# Altium schematic sheet Main.SchDoc: Connectors
size B; DocumentNumber: 1; SheetNumber: 1; SheetTotal: 6
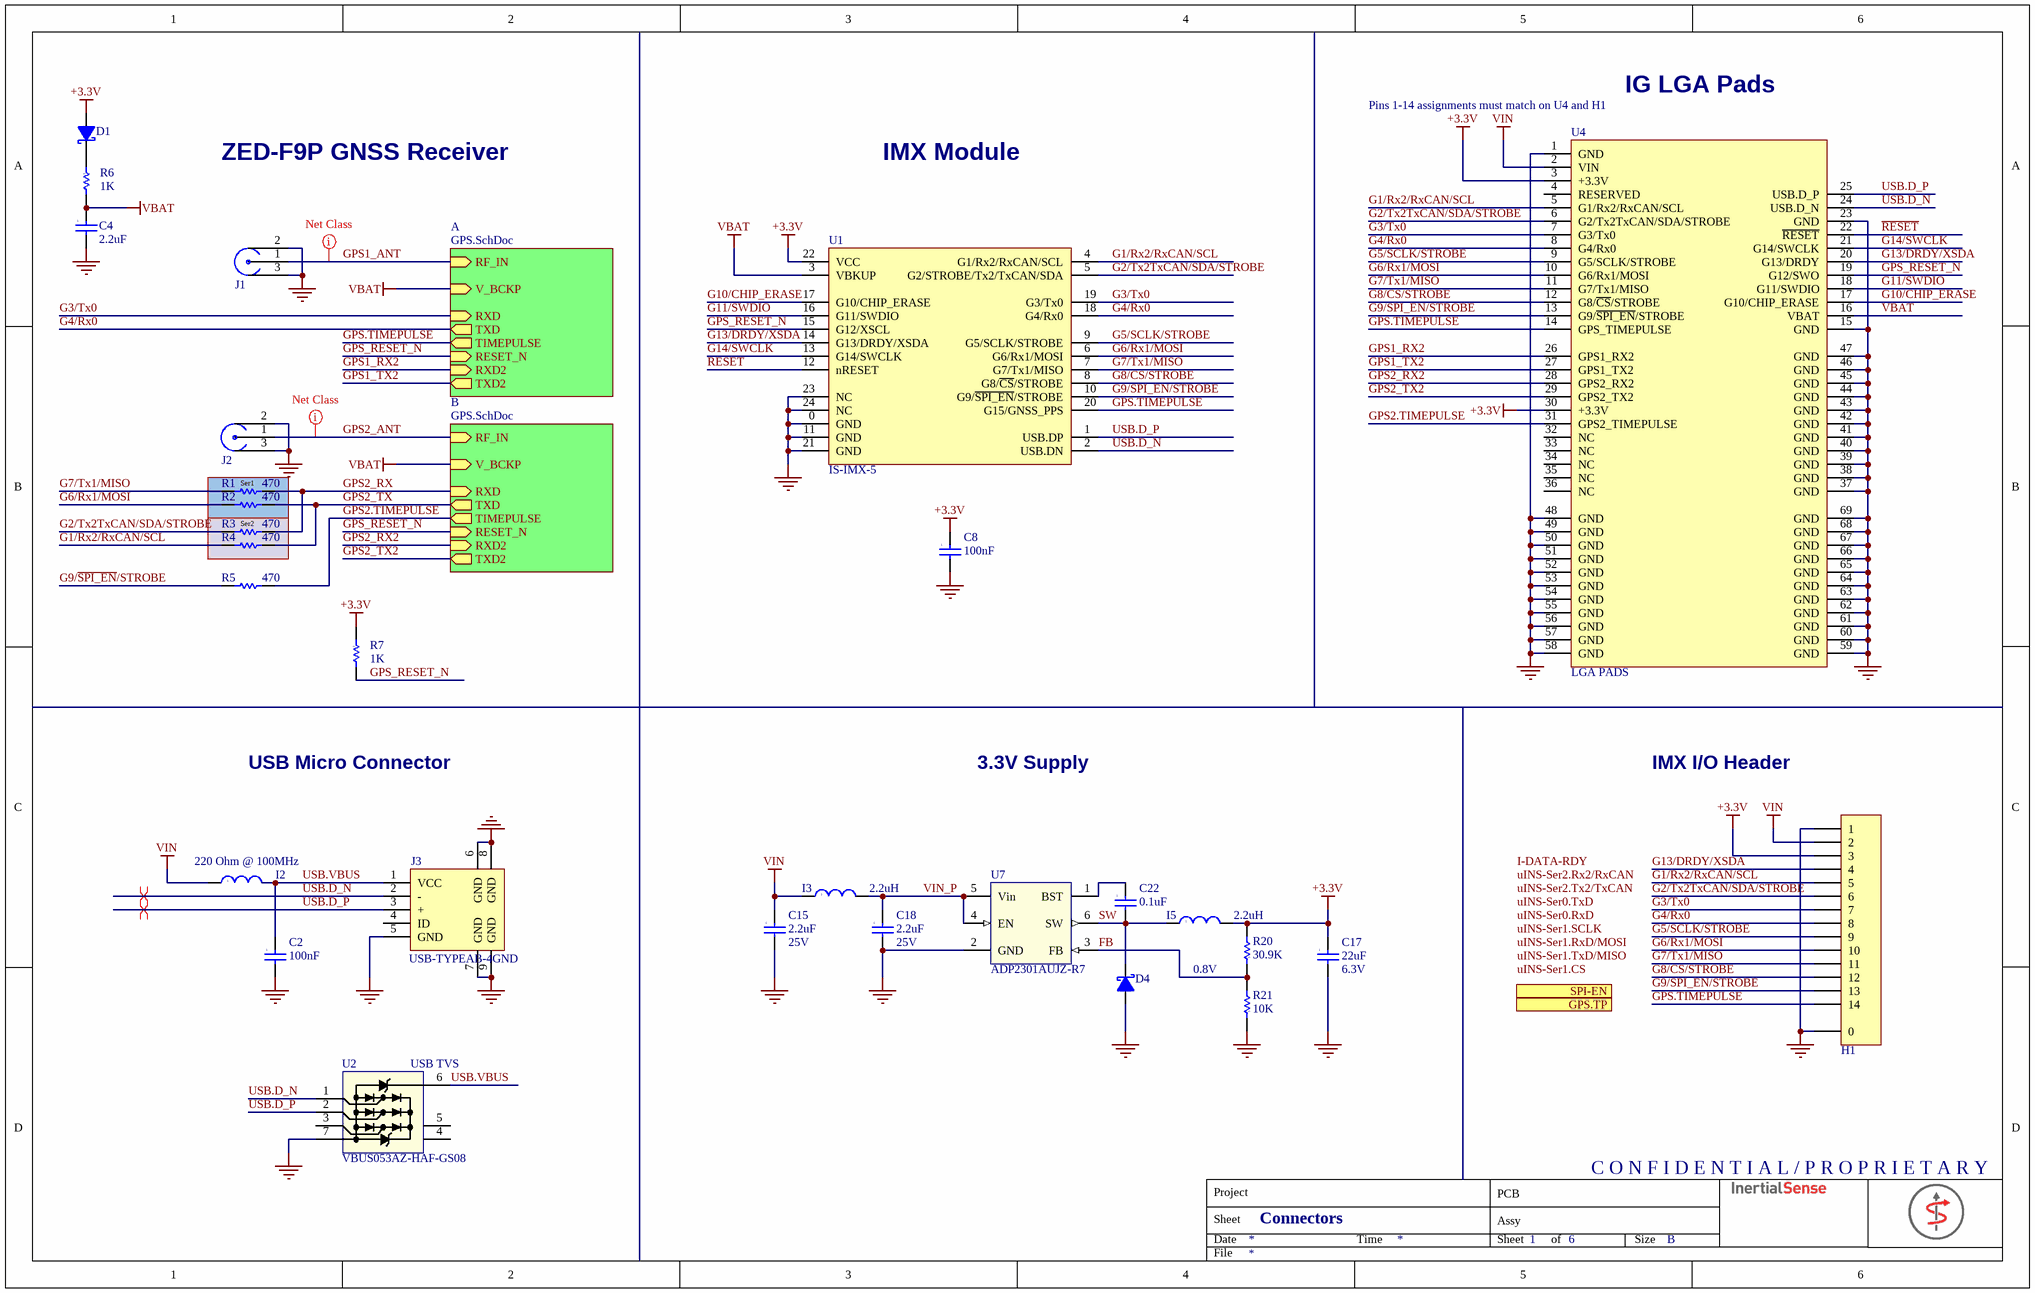
[diagram p0: Main.SchDoc]

## Parts
C2  value 100nF  [0402]  (hidden comment: Cap)
C4  value 2.2uF  [0402]  (hidden comment: Cap)
C8  value 100nF  [0402]  (hidden comment: Cap)
C15  value 2.2uF  Voltage Rating: 25V  [0603]  (hidden comment: Cap)
C17  value 22uF  Voltage Rating: 6.3V  [0603]  (hidden comment: Cap)
C18  value 2.2uF  Voltage Rating: 25V  [0603]  (hidden comment: Cap)
C22  value 0.1uF  [0402]  (hidden comment: Cap)
D1  Diode - Schottky  [D0603B]  (value not drawn)
D4  Diode - Schottky  [D0603B]  (value not drawn)
H1  Hdr - 14pin - mount  [SM14B-GHS-TB(LF)(SN)]  (value not drawn)
I2  value 220 Ohm @ 100MHz  [I0603]  (hidden comment: Inductor)
I3  value 2.2uH  [0806]  (hidden comment: Inductor)
I5  value 2.2uH  [0806]  (hidden comment: Inductor)
J1  RF - GND x 2  [RF UMC SMD]  (value not drawn)
J2  RF - GND x 2  [RF UMC SMD]  (value not drawn)
J3  USB-TYPEAB-4GND  [USB Micro AB R/A THR]
R1  value 470  [R0402]  (hidden comment: Res)
R2  value 470  [R0402]  (hidden comment: Res)
R3  value 470  [R0402]  (hidden comment: Res)
R4  value 470  [R0402]  (hidden comment: Res)
R5  value 470  [R0402]  (hidden comment: Res)
R6  value 1K  [R0402]  (hidden comment: Res)
R7  value 1K  [R0402]  (hidden comment: Res)
R20  value 30.9K  [R0402]  (hidden comment: Res)
R21  value 10K  [R0402]  (hidden comment: Res)
U1  Manufacturer Part Number: IS-IMX-5  [IS-IMX-5.0]  (hidden comment: IMX)
U2  Manufacturer Part Number: VBUS053AZ-HAF-GS08  [QFN50P160X160X60-6N]  (hidden comment: VBUS053)
U4  LGA PADS  [IG-1.2-G2_LGA]
U7  Manufacturer Part Number: ADP2301AUJZ-R7  [MO-178-AB]  (hidden comment: ADP2301)

## Sub-sheets
A = GPS.SchDoc: TXD (out), TIMEPULSE (out), RXD (in), V_BCKP (in), RF_IN (in), RESET_N (in), TXD2 (out), RXD2 (in)
B = GPS.SchDoc: TXD (out), TIMEPULSE (out), RXD (in), V_BCKP (in), RF_IN (in), RESET_N (in), TXD2 (out), RXD2 (in)

## Ports
GPS.TP (out), SPI-EN (in)

## Nets
+3.3V: C8.1 C17.1 D1.A H1.3 I5.2 R7.1 R20.2 U1.22(VCC) U4.3(+3.3V) U4.30(+3.3V)
GND: C2.2 C4.2 C8.2 C15.2 C17.2 C18.2 D4.A H1.0 H1.1 J1.2 J1.3 J2.2 J2.3 J3.5(GND) J3.6(GND) J3.7(GND) J3.8(GND) J3.9(GND) R21.1 U1.0(GND) U1.11(GND) U1.21(GND) U1.23(NC) U1.24(NC) U2.7 U4.1(GND) U4.15(GND) U4.23(GND) U4.37(GND) U4.38(GND) U4.39(GND) U4.40(GND) U4.41(GND) U4.42(GND) U4.43(GND) U4.44(GND) U4.45(GND) U4.46(GND) U4.47(GND) U4.48(GND) U4.49(GND) U4.50(GND) U4.51(GND) U4.52(GND) U4.53(GND) U4.54(GND) U4.55(GND) U4.56(GND) U4.57(GND) U4.58(GND) U4.59(GND) U4.60(GND) U4.61(GND) U4.62(GND) U4.63(GND) U4.64(GND) U4.65(GND) U4.66(GND) U4.67(GND) U4.68(GND) U4.69(GND) U7.2(GND)
VBAT: C4.1 R6.2 U1.3(VBKUP) U4.16(VBAT) ; sheet A/V_BCKP, sheet B/V_BCKP
VIN: C15.1 H1.2 I2.1 I3.1 U4.2(VIN)
~{RESET}: U1.12(nRESET) U4.22(~{RESET})
FB: R20.1 R21.2 U7.3(FB)
G1/Rx2/RxCAN/SCL: H1.5 R4.1 U1.4(G1/Rx2/RxCAN/SCL) U4.5(G1/Rx2/RxCAN/SCL)
G2/Tx2TxCAN/SDA/STROBE: H1.6 R3.1 U1.5(G2/STROBE/Tx2/TxCAN/SDA) U4.6(G2/Tx2TxCAN/SDA/STROBE)
G3/Tx0: H1.7 U1.19(G3/Tx0) U4.7(G3/Tx0) ; sheet A/RXD
G4/Rx0: H1.8 U1.18(G4/Rx0) U4.8(G4/Rx0) ; sheet A/TXD
G5/SCLK/STROBE: H1.9 U1.9(G5/SCLK/STROBE) U4.9(G5/SCLK/STROBE)
G6/Rx1/MOSI: H1.10 R2.1 U1.6(G6/Rx1/MOSI) U4.10(G6/Rx1/MOSI)
G7/Tx1/MISO: H1.11 R1.1 U1.7(G7/Tx1/MISO) U4.11(G7/Tx1/MISO)
G8/~{CS}/STROBE: H1.12 U1.8(G8/~{CS}/STROBE) U4.12(G8/~{CS}/STROBE)
G9/~{SPI_EN}/STROBE: H1.13 R5.1 U1.10(G9/~{SPI_EN}/STROBE) U4.13(G9/~{SPI_EN}/STROBE)
G10/CHIP_ERASE: U1.17(G10/CHIP_ERASE) U4.17(G10/CHIP_ERASE)
G11/SWDIO: U1.16(G11/SWDIO) U4.18(G11/SWDIO)
G13/DRDY/XSDA: H1.4 U1.14(G13/DRDY/XSDA) U4.20(G13/DRDY)
G14/SWCLK: U1.13(G14/SWCLK) U4.21(G14/SWCLK)
GPS1_ANT: J1.1 ; sheet A/RF_IN
GPS1_RX2: U4.26(GPS1_RX2) ; sheet A/RXD2
GPS1_TX2: U4.27(GPS1_TX2) ; sheet A/TXD2
GPS2.TIMEPULSE: R5.2 U4.31(GPS2_TIMEPULSE) ; sheet B/TIMEPULSE
GPS2_ANT: J2.1 ; sheet B/RF_IN
GPS2_RX: R1.2 R3.2 ; sheet B/RXD
GPS2_RX2: U4.28(GPS2_RX2) ; sheet B/RXD2
GPS2_TX: R2.2 R4.2 ; sheet B/TXD
GPS2_TX2: U4.29(GPS2_TX2) ; sheet B/TXD2
GPS.TIMEPULSE: H1.14 U1.20(G15/GNSS_PPS) U4.14(GPS_TIMEPULSE) ; sheet A/TIMEPULSE
GPS_RESET_N: R7.2 U1.15(G12/XSCL) U4.19(G12/SWO) ; sheet A/RESET_N, sheet B/RESET_N
SW: C22.2 D4.C I5.1 U7.6(SW)
USB.D_N: J3.2(-) U1.2(USB.DN) U2.1 U4.24(USB.D_N)
USB.D_P: J3.3(+) U1.1(USB.DP) U2.2 U4.25(USB.D_P)
USB.VBUS: C2.1 I2.2 J3.1(VCC) U2.6
VIN_P: C18.1 I3.2 U7.4(EN) U7.5(Vin)
NetC22_1: C22.1 U7.1(BST)
NetD1_C: D1.C R6.1

Not connected (* = marked no-connect by the designer): J3 4(ID); U2 3 4(nc) 5(nc); U4 4(RESERVED) 32(NC) 33(NC) 34(NC) 35(NC) 36(NC)

## Layout directives
net class RF_GPS: GPS1_ANT, GPS2_ANT
differential pair; differential pair class USB: USB.D_N, USB.D_P

## Notes on the sheet
- IG LGA Pads
- ZED-F9P GNSS Receiver
- IMX Module
- (near U4) Pins 1-14 assignments must match on U4 and H1
- Ser1
- Ser2
- USB Micro Connector
- 3.3V Supply
- IMX I/O Header
- 0.8V
- (near U2) USB TVS
- Labels drawn without touching a wire or pin: I-DATA-RDY, uINS-Ser0.RxD, uINS-Ser0.TxD, uINS-Ser1.CS, uINS-Ser1.RxD/MOSI, uINS-Ser1.SCLK, uINS-Ser1.TxD/MISO, uINS-Ser2.Rx2/RxCAN, uINS-Ser2.Tx2/TxCAN
- C O N F I D E N T I A L / P R O P R I E T A R Y
- Date
- Sheet
- Project
- Time
- PCB
- Assy
- of
- Size
- B
- File

## Library data of the parts
C2 C8 = Cap: CAP CER .10UF 50V X7R 10% 0402; Manufacturer: TDK Corporation; Manufacturer Part Number: C1005X7R1H104K; Capacitance: 0.1µF; Published: 8-Jun-2000; LatestRevisionDate: 17-Jul-2002; LatestRevisionNote: Re-released for DXP Platform.; Publisher: Altium Limited; Category: Capacitors; Supplier 1: Digi-Key; Supplier Part Number 1: 445-5932-1-ND; RoHS: RoHS Compliant; Stock 1: 174080; Pricing 1: 1=0.3, 10=0.2, 100=0.08, 250=0.05752, 500=0.041, 1000=0.03 (USD); Voltage - Rated: 50V; Tolerance: ±10%; Temperature Coefficient: X7R; Mounting Type: Surface Mount, MLCC; Operating Temperature: -55°C ~ 125°C; Applications: General Purpose; Ratings: -; Package / Case: 0402 (1005 Metric); Size / Dimension: 0.039" L x 0.020" W (1.00mm x 0.50mm); Height: -; Thickness: 0.022" (0.55mm); Lead Spacing: -; Features: -; Packaging: Cut Tape (CT); Lead Style: -; ComponentLink1URL: http://www.tdk.co.jp/tefe02/e412_c.pdf; ComponentLink1Description: http://www.tdk.co.jp/tefe02/e412_c.pdf
C4 = Cap: 0402 2.2 uF 6.3 V ±10% Tolerance X6S Multilayer Ceramic Capacitor; Manufacturer: Murata; Manufacturer Part Number: GRM155C80J225KE95D; Voltage Rating: 6.3V; Published: 8-Jun-2000; LatestRevisionDate: 17-Jul-2002; LatestRevisionNote: Re-released for DXP Platform.; Publisher: Altium Limited; Category: Capacitors; Supplier: Digi-Key; Supplier Part Number: 490-10012-2-ND; RoHS: Yes; Stock: 7200000; Pricing: 10000=0.01548, 20000=0.01475, 30000=0.01401, 50000=0.01253, 100000=0.01014, 250000=0.00922 (USD); Mounting Technology: Surface Mount; Case/Package: 0402; Case Code (Metric): 1005; Material: Ceramic; Case Code (Imperial): 0402; Min Operating Temperature: -55°C; Max Operating Temperature: 105°C; Tolerance: 10%; Packaging: Cut Tape; Voltage Rating (DC): 6.3V; Series: GRM; Length: 0.039inch; Width: 0.02inch; Height: 0.3mm; Thickness: 0.022inch; RoHS Compliant: Yes; ComponentLink1URL: http://search.murata.co.jp/Ceramy/image/img/A01X/G101/ENG/GRM155C80J225KE95-01.pdf?src-supplier=Digi-Key; ComponentLink1Description: http://search.murata.co.jp/Ceramy/image/img/A01X/G101/ENG/GRM155C80J225KE95-01.pdf?src-supplier=Digi-Key; ComponentLink2URL: http://search.murata.co.jp/Ceramy/image/img/A01X/partnumbering_e_01.pdf?src-supplier=Digi-Key; ComponentLink2Description: http://search.murata.co.jp/Ceramy/image/img/A01X/partnumbering_e_01.pdf?src-supplier=Digi-Key
C15 C18 = Cap: CAP CER 2.2UF 25V X6S 0603; Manufacturer: Murata; Manufacturer Part Number: GRT188C81E225KE13D; Tolerance: 10%; Published: 8-Jun-2000; LatestRevisionDate: 17-Jul-2002; LatestRevisionNote: Re-released for DXP Platform.; Publisher: Altium Limited; Category: Capacitors; Supplier 1: Digi-Key; Supplier Part Number 1: 490-12293-6-ND; Stock 1: 16854; Pricing 1: 1=0.35, 10=0.239, 100=0.1355, 500=0.09564, 1000=0.08369 (USD); Mount: Surface Mount; Case/Package: 0603; Case Code (Metric): 1608; Case Code (Imperial): 0603; Min Operating Temperature: -55°C; Max Operating Temperature: 105°C; Packaging: Tape and Reel; Capacitance: 2.2uF; Dielectric: X6S; Voltage Rating (DC): 25V; Length: 0.063inch; Width: 0.031inch; Thickness: 0.035inch; ComponentLink1URL: http://www.farnell.com/datasheets/2165949.pdf; ComponentLink1Description: http://www.farnell.com/datasheets/2165949.pdf; ComponentLink2URL: http://search.murata.co.jp/Ceramy/image/img/A01X/G101/ENG/GRT188C81E225KE13-01.pdf; ComponentLink2Description: http://search.murata.co.jp/Ceramy/image/img/A01X/G101/ENG/GRT188C81E225KE13-01.pdf
C17 = Cap: CAP CER 22UF 6.3V X6S 0603; Manufacturer: Murata; Manufacturer Part Number: GRM188C80J226ME15D; Tolerance: 20%; Published: 8-Jun-2000; LatestRevisionDate: 17-Jul-2002; LatestRevisionNote: Re-released for DXP Platform.; Publisher: Altium Limited; Category: Capacitors; Supplier 1: Digi-Key; Supplier Part Number 1: 490-10471-6-ND; Stock 1: 0; Pricing 1: 1=0.25, 10=0.168, 100=0.0955, 500=0.0674, 1000=0.05897 (USD); Mount: Surface Mount; Case/Package: 0603; Weight: 0.000222oz; Case Code (Metric): 1608; Case Code (Imperial): 0603; Min Operating Temperature: -55°C; Max Operating Temperature: 105°C; Capacitance: 22uF; Packaging: Tape and Reel; Dielectric: X6S; Termination: SMD/SMT; Voltage Rating (DC): 6.3V; Package Quantity: 4000; Length: 0.063inch; Height: 0.8mm; Width: 0.8mm; Thickness: 0.039inch; Lead Free: Lead Free; ComponentLink1URL: http://www.mouser.com/ds/2/281/c02e-2905.pdf; ComponentLink1Description: http://www.mouser.com/ds/2/281/c02e-2905.pdf; ComponentLink2URL: http://search.murata.co.jp/Ceramy/image/img/A01X/partnumbering_e_01.pdf; ComponentLink2Description: http://search.murata.co.jp/Ceramy/image/img/A01X/partnumbering_e_01.pdf
C22 = Cap: CAP CER 0.1UF 50V X7R 0402; Manufacturer: TDK; Manufacturer Part Number: CGA2B3X7R1H104K050BB; Tolerance: 10%; Published: 8-Jun-2000; LatestRevisionDate: 17-Jul-2002; LatestRevisionNote: Re-released for DXP Platform.; Publisher: Altium Limited; Category: Capacitors; Supplier 1: Digi-Key; Supplier Part Number 1: 445-6899-1-ND; Stock 1: 12402793; Pricing 1: 1=0.16000, 10=0.11700, 100=0.05500, 500=0.03858, 1000=0.03194, 2500=0.02973, 5000=0.02720 (USD); RoHS: Yes; Mount: Surface Mount; Case/Package: 0402; Weight: 2.3E-05oz; Case Code (Metric): 1005; Case Code (Imperial): 0402; Min Operating Temperature: -55°C; Max Operating Temperature: 125°C; Voltage Rating: 50V; Capacitance: 0.1uF; Packaging: Tape and Reel; Voltage Rating (DC): 50V; Dielectric: X7R; Termination: SMD/SMT; Package Quantity: 1; Composition: Ceramic; Voltage: 50V; Length: 1mm; Height: 0.5mm; Depth: 0.5mm; Width: 0.02inch; Thickness: 0.022inch; Ratings: AEC-Q200; Lead Free: Lead Free; REACH SVHC: No SVHC; ComponentLink1URL: https://datasheet.ciiva.com/16498/mlccspec-automotive-general-midvoltage-en-16498528.pdf?src-supplier=Future+Electronics; ComponentLink1Description: https://datasheet.ciiva.com/16498/mlccspec-automotive-general-midvoltage-en-16498528.pdf?src-supplier=Future+Electronics; ComponentLink2URL: https://datasheet.ciiva.com/24216/cga2b3x7r1h104k050bb-266281-24216070.pdf?src-supplier=Mouser; ComponentLink2Description: https://datasheet.ciiva.com/24216/cga2b3x7r1h104k050bb-266281-24216070.pdf?src-supplier=Mouser; ComponentLink3URL: https://datasheet.ciiva.com/7975/1788388-7975306.pdf?src-supplier=Element14; ComponentLink3Description: https://datasheet.ciiva.com/7975/1788388-7975306.pdf?src-supplier=Element14; ComponentLink4URL: https://datasheet.ciiva.com/22703/1807242-22703013.pdf?src-supplier=Element14; ComponentLink4Description: https://datasheet.ciiva.com/22703/1807242-22703013.pdf?src-supplier=Element14; ComponentLink5URL: https://datasheet.ciiva.com/22725/1735392-22725627.pdf?src-supplier=Element14; ComponentLink5Description: https://datasheet.ciiva.com/22725/1735392-22725627.pdf?src-supplier=Element14
D1 D4 = Diode - Schottky: DIODE SCHOTTKY 30V 2A 0603; Manufacturer: Vishay; Manufacturer Part Number: VSKY20301608-G4-08; Supplier 1: Digi-Key; Supplier Part Number 1: VSKY20301608-G4-08GICT-ND; Stock 1: 13064; Pricing 1: 1=0.38, 10=0.305, 25=0.2792, 100=0.2076, 250=0.1882, 500=0.15574, 1000=0.1168, 2500=0.10707 (USD); ComponentLink1URL: http://www.mouser.com/ds/2/427/vsky20301608-777242.pdf; ComponentLink1Description: http://www.mouser.com/ds/2/427/vsky20301608-777242.pdf
H1 = Hdr - 14pin - mount: Conn Shrouded Header HDR 14 POS 1.25mm Solder ST Top Entry SMD T/R; Manufacturer: JST; Supplier 1: Digi-Key; Supplier Part Number 1: 455-1576-2-ND; Manufacturer Part Number: SM14B-GHS-TB(LF)(SN); RoHS: No; Category: Connectors; Pricing 1: 2500=0.35044, 5000=0.33876, 12500=0.31072, 25000=0.30371 (USD)
I2 = Inductor: FERRITE CHIP 220 OHM 2500MA 0603; Manufacturer: Murata Electronics North America; Manufacturer Part Number: BLM18SG221TN1D; Current Rating: 2.5A; DC Resistance (DCR): 40 mOhm Max; Filter Type: Differential Mode - Single; Supplier 1: Digi-Key; Supplier Part Number 1: 490-5225-1-ND; RoHS: RoHS Compliant; Category: Filters; Stock 1: 146728; Pricing 1: 1=0.14, 10=0.116, 50=0.075, 100=0.0646, 250=0.05172, 500=0.04654, 1000=0.03878, 5000=0.03619 (USD); Packaging: Cut Tape (CT); Impedance @ Frequency: 220 Ohm @ 100MHz; Package / Case: 0603 (1608 Metric); Mounting Type: Surface Mount; Height (Max): 0.037" (0.95mm); Size / Dimension: 0.063" L x 0.031" W (1.60mm x 0.80mm); ComponentLink1URL: http://search.murata.co.jp/Ceramy/image/img/PDF/ENG/L0110S0100BLM18S.pdf; ComponentLink1Description: http://search.murata.co.jp/Ceramy/image/img/PDF/ENG/L0110S0100BLM18S.pdf
I3 I5 = Inductor: FIXED IND 2.2UH 1.2A 110 MOHM; Manufacturer: TDK; Manufacturer Part Number: MLP2016H2R2MT0S1; Core Material: Ferrite; Tolerance: 20%; Shielding: Unshielded; DC Resistance (DCR): 137.5mR; Test Frequency: 2MHz; Supplier 1: Digi-Key; Supplier Part Number 1: 445-15724-6-ND; Stock 1: 14048; Pricing 1: 1=0.38, 10=0.335, 100=0.2302, 500=0.19674, 1000=0.1507 (USD); Mount: Surface Mount; Case/Package: 0806; Case Code (Metric): 2016; Case Code (Imperial): 0806; Min Operating Temperature: -40°C; Max Operating Temperature: 125°C; Package Quantity: 3000; Packaging: Tape and Reel; Current Rating: 1.2A; Inductance: 2.2uh; Length: 0.079inch; Width: 0.063inch; Height - Seated (Max): 0.039inch; Lead Free: Lead Free; ComponentLink1URL: https://datasheet.ciiva.com/29697/inductor-commercial-power-mlp-en-29697725.pdf; ComponentLink1Description: https://datasheet.ciiva.com/29697/inductor-commercial-power-mlp-en-29697725.pdf; ComponentLink2URL: https://datasheet.ciiva.com/29697/inductor-commercial-power-mlp-en-29697726.pdf; ComponentLink2Description: https://datasheet.ciiva.com/29697/inductor-commercial-power-mlp-en-29697726.pdf
J1 J2 = RF - GND x 2: CONN UMC RCPT STR 50 OHM SMD; Manufacturer: Emerson Network Power Connectivity Johnson; Manufacturer Part Number: 128-0711-201; Connector Style: Ultra Miniature Coaxial; Connector Type: Receptacle, Male Pins; Contact Termination: Solder; Impedance: 50 Ohm; Frequency - Max: 6GHz; Body Finish: Gold; Voltage Rating: 200V; Supplier 1: Digi-Key; Supplier Part Number 1: J983CT-ND; RoHS: RoHS Compliant; Category: Connectors, Interconnects; Stock 1: 1514; Pricing 1: 1=0.93, 10=0.832, 50=0.784, 100=0.672, 250=0.576, 500=0.544, 750=0.48, 1000=0.448 (USD); Packaging: Cut Tape (CT); Shield Termination: Solder; Mounting Type: Surface Mount; Cable Group: -; Fastening Type: Snap-On; Features: -; Housing Color: Gold; Ingress Protection: -; Body Material: -; Center Contact Material: -; Center Contact Plating: Gold; Dielectric Material: -; Operating Temperature: -40°C ~ 90°C; ComponentLink1URL: http://media.digikey.com/pdf/Data%20Sheets/Emerson%20PDFs/UMC%20Product%20Catalog.pdf; ComponentLink1Description: http://media.digikey.com/pdf/Data%20Sheets/Emerson%20PDFs/UMC%20Product%20Catalog.pdf
J3 = USB-TYPEAB-4GND: CONN USB AB 4POS; Manufacturer: Amphenol FCI; Manufacturer Part Number: 10118194-0001LF; Gender: Receptacle; Current Rating: 1.8A; Connector Type: USB,Receptacle; Number of Contacts: 5; Insulation Resistance: 1GR; Number of Ports: 1; Max Voltage Rating (AC): 100V; Pitch: 0.65mm; Supplier 1: Digi-Key; Supplier Part Number 1: 609-4618-1-ND; Stock 1: 77572; Pricing 1: 1=0.48, 10=0.447, 25=0.402, 50=0.3574, 100=0.3424, 250=0.31264, 500=0.29776 (USD); Mount: Surface Mount,Horizontal; Contact Material: Copper Alloy; Contact Plating: Gold; Number of Terminals: 5; Housing Material: Polymer; Colour: Black; Min Operating Temperature: -55°C; Max Operating Temperature: 85°C; Package Quantity: 9600; Packaging: Tape and Reel; Termination: Solder; Orientation: Right Angle; Features: Shielded; Length: 8.05mm; Depth: 5mm; Radiation Hardening: No; Lead Free: Lead Free; Flammability Rating: UL94 V-0; ComponentLink1URL: https://datasheet.ciiva.com/851/10118194-851110.pdf; ComponentLink1Description: https://datasheet.ciiva.com/851/10118194-851110.pdf; ComponentLink2URL: https://datasheet.ciiva.com/851/10118194-851111.pdf; ComponentLink2Description: https://datasheet.ciiva.com/851/10118194-851111.pdf; ComponentLink3URL: https://datasheet.ciiva.com/4598/10118194ac-197217-4598807.pdf; ComponentLink3Description: https://datasheet.ciiva.com/4598/10118194ac-197217-4598807.pdf; ComponentLink4URL: https://datasheet.ciiva.com/29907/10118194-29907230.pdf; ComponentLink4Description: https://datasheet.ciiva.com/29907/10118194-29907230.pdf; ComponentLink5URL: https://datasheet.ciiva.com/26945/getdatasheetpartid-418619-26945695.pdf; ComponentLink5Description: https://datasheet.ciiva.com/26945/getdatasheetpartid-418619-26945695.pdf
R1-R5 = Res: RES 470 OHM 1/16W 1% 0402 SMD; Manufacturer: Vishay Dale; Manufacturer Part Number: CRCW0402470RFKED; Power (Watts): 0.063W, 1/16W; Temperature Coefficient: ±100ppm/°C; Supplier 1: Digi-Key; Supplier Part Number 1: 541-470LCT-ND; RoHS: RoHS Compliant; Category: Resistors; Stock 1: 121698; Pricing 1: 10=0.083, 50=0.0444, 200=0.0255, 1000=0.0174 (USD); Packaging: Cut Tape (CT); Resistance (Ohms): 470; Tolerance: ±1%; Composition: Thick Film; Features: Automotive AEC-Q200 Qualified; Package / Case: 0402 (1005 Metric); Supplier Device Package: 0402 (1005 Metric); Size / Dimension: 0.039" L x 0.020" W (1.00mm x 0.50mm); Height: 0.016" (0.40mm); Number of Terminations: 2; ComponentLink1URL: http://www.vishay.com/doc?20035; ComponentLink1Description: http://www.vishay.com/doc?20035
R6 R7 = Res: 1 kOhms ¡À1% 0.063W, 1/16W Chip Resistor 0402 (1005 Metric) Moisture Resistant Thick Film; Manufacturer: Yageo; Manufacturer Part Number: RC0402FR-071KL; Tolerance: 1%; Temperature Coefficient: 100ppm/°C; Power Rating: 62.5mW; Voltage Rating: 50V; Max Power Dissipation: 63mW; Supplier: Digi-Key; Supplier Part Number: 311-1.00KLRTR-ND; RoHS: Yes; Category: Chip SMD Resistors; Stock: 29757748; Pricing: 10000=0.00261, 20000=0.00231, 30000=0.00216, 50000=0.00199, 100000=0.00179 (USD); Case/Package: 0402; Pins: 2; Case Code (Imperial): 0402; Case Code (Metric): 1005; Min Operating Temperature: -55°C; Max Operating Temperature: 155°C; Resistor Type: Thick Film; Packaging: Tape and Reel; Voltage Rating (DC): 50V; Termination: SMD/SMT; Features: Moisture Resistant; Series: RC; Number of Terminations: 2; Resistance Tolerance: 1%; Construction: Rectangular; Technology: THICK FILM; Length: 1mm; Width: 0.5mm; Height: 0.32mm; Depth: 0.5mm; RoHS Compliant: Yes; Reach SVHC Compliant: No; Military Standard: Not; Lead Free: Lead Free; ComponentLink1URL: https://datasheet.ciiva.com/11819/0900766b80c66297-11819477.pdf?src-supplier=Rs; ComponentLink1Description: https://datasheet.ciiva.com/11819/0900766b80c66297-11819477.pdf?src-supplier=Rs; ComponentLink2URL: https://datasheet.ciiva.com/7983/1018594-7983502.pdf?src-supplier=Element14; ComponentLink2Description: https://datasheet.ciiva.com/7983/1018594-7983502.pdf?src-supplier=Element14; ComponentLink3URL: https://datasheet.ciiva.com/22747/1018594-22747513.pdf?src-supplier=Element14; ComponentLink3Description: https://datasheet.ciiva.com/22747/1018594-22747513.pdf?src-supplier=Element14; ComponentLink4URL: https://datasheet.ciiva.com/12666/pyu-rc0402-51-rohs-l-6-r-12666741.pdf?src-supplier=Mouser; ComponentLink4Description: https://datasheet.ciiva.com/12666/pyu-rc0402-51-rohs-l-6-r-12666741.pdf?src-supplier=Mouser; ComponentLink5URL: https://datasheet.ciiva.com/7849/1018594-7849869.pdf?src-supplier=Element14; ComponentLink5Description: https://datasheet.ciiva.com/7849/1018594-7849869.pdf?src-supplier=Element14; ComponentLink6URL: https://datasheet.ciiva.com/7849/1018594-7849871.pdf?src-supplier=Element14; ComponentLink6Description: https://datasheet.ciiva.com/7849/1018594-7849871.pdf?src-supplier=Element14; ComponentLink7URL: https://datasheet.ciiva.com/17063/pyu-rc0402-51-rohs-l-6-r-17063193.pdf?src-supplier=Future+Electronics; ComponentLink7Description: https://datasheet.ciiva.com/17063/pyu-rc0402-51-rohs-l-6-r-17063193.pdf?src-supplier=Future+Electronics
R20 = Res: RES TF 30.9K OHM 1% 1/16W 0402; Manufacturer: Stackpole Electronics Inc; Manufacturer Part Number: RMCF0402FT30K9; Power (Watts): 0.063W, 1/16W; Temperature Coefficient: ±100ppm/°C; LatestRevisionDate: 2-Dec-2009; Supplier 1: Digi-Key; Supplier Part Number 1: RMCF0402FT30K9CT-ND; RoHS: RoHS Compliant; Category: Resistors; Stock 1: 6328; Pricing 1: 1=0.04, 10=0.025, 50=0.0138, 100=0.0105, 250=0.0078, 500=0.00576, 1000=0.00384 (USD); Resistance (Ohms): 30.9K; Composition: Thick Film; Features: -; Tolerance: ±1%; Size / Dimension: 0.039" L x 0.020" W (1.00mm x 0.50mm); Height: 0.016" (0.40mm); Number of Terminations: 2; Packaging: Cut Tape (CT); Package / Case: 0402 (1005 Metric); ComponentLink1URL: http://www.seielect.com/Catalog/SEI-RMCF.pdf; ComponentLink1Description: http://www.seielect.com/Catalog/SEI-RMCF.pdf
R21 = Res: RES 10.0K OHM 1/16W 1% 0402 SMD; Manufacturer: Yageo; Manufacturer Part Number: RC0402FR-0710KL; Power (Watts): 0.063W, 1/16W; Temperature Coefficient: ±100ppm/°C; LatestRevisionDate: 2-Dec-2009; Supplier 1: Digi-Key; Supplier Part Number 1: 311-10.0KLRCT-ND; RoHS: RoHS Compliant; Category: Resistors; Stock 1: 5597980; Pricing 1: 10=0.014, 50=0.0104, 100=0.0079, 250=0.00584, 500=0.00432, 1000=0.00288 (USD); Resistance (Ohms): 10K; Composition: Thick Film; Features: -; Tolerance: ±1%; Size / Dimension: 0.039" L x 0.020" W (1.00mm x 0.50mm); Height: 0.014" (0.35mm); Number of Terminations: 2; Packaging: Cut Tape (CT); Package / Case: 0402 (1005 Metric); ComponentLink1URL: http://www.yageo.com/documents/recent/PYu-RC0402_51_RoHS_L_6.pdf; ComponentLink1Description: http://www.yageo.com/documents/recent/PYu-RC0402_51_RoHS_L_6.pdf
U1 = IS-IMX-5.0: Inertial Sense IMX; Manufacturer: Inertial Sense; Supplier 1: Inertial Sense; Supplier Part Number 1: IS-IMX-5
U2 = VBUS053: ESD SUPPRESS 5.5V 36W 3-Line USB; Manufacturer: Vishay Semiconductors; Breakdown Voltage: 6.5 V; Capacitance: 0.7 pF; Clamping Voltage: 18 V; Operating Voltage: 5.5 V (Min); Supplier 1: Mouser; RoHS: RoHS Compliant; Category: ESD Suppressors; Stock 1: 8176; Pricing 1: 1=1.04, 10=0.918, 50=0.805, 100=0.689, 500=0.574, 1000=0.446, 3000=0.366, 9000=0.335 (AUD); Operating Temperature Range: - 40 C to + 125 C; Package / Case: LLP-75; Packaging: Reel; Series: VBUS053AZ-HAF; Product Category: Transient Voltage Suppressors; RoHS - Mouser: Y; Minimum Order Quantity: 1; Reeling: True; ComponentLink1URL: http://www.vishay.com/docs/81845/vbus053a.pdf; ComponentLink1Description: http://www.vishay.com/docs/81845/vbus053a.pdf; Supplier Part Number 1: 78-VBUS053AZ-HAF
U4 = IG_1.2-G2_LGA: IMX multi-frequency RTK-GNSS Module
U7 = ADP2301: IC BUCK ADJ 1.2A 6TSOT; Manufacturer: Analog Devices Inc; Output Type: Adjustable; Number of Outputs: 1; Voltage - Output: 0.8 V ~ 17 V; Voltage - Input: 3 V ~ 20 V; PWM Type: Current Mode; Frequency - Switching: 1.4MHz; Synchronous Rectifier: No; Supplier 1: Digi-Key; RoHS: RoHS Compliant; Category: Integrated Circuits (ICs); Stock 1: 6699; Pricing 1: 1=3.06, 25=2.4992, 100=2.244, 250=2.04, 500=1.785, 1000=1.53 (USD); Type: Step-Down (Buck); Current - Output: 1.2A; Operating Temperature: -40°C ~ 125°C; Mounting Type: Surface Mount; Package / Case: SOT-23-6 Thin, TSOT-23-6; Packaging: Cut Tape (CT); Supplier Device Package: TSOT-6; ComponentLink1URL: http://www.analog.com/static/imported-files/data_sheets/ADP2300_2301.pdf; ComponentLink1Description: http://www.analog.com/static/imported-files/data_sheets/ADP2300_2301.pdf; Supplier Part Number 1: ADP2301AUJZ-R7CT-ND